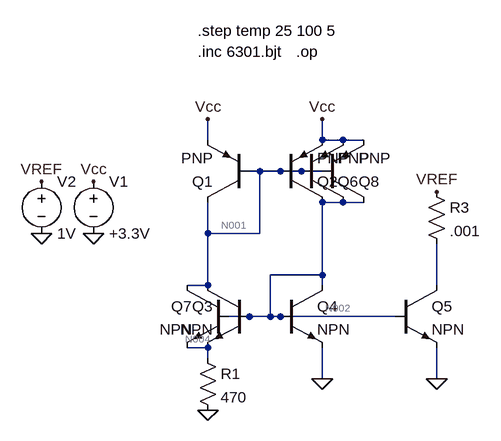
[diagram p0: schematic ptat.asc]
ptat.asc, the LTspice schematic file:
Version 4
SHEET 1 880 680
WIRE 64 48 64 16
WIRE 240 48 240 16
WIRE 272 48 240 48
WIRE 304 48 272 48
WIRE 144 96 128 96
WIRE 176 96 144 96
WIRE 208 96 176 96
WIRE 240 96 208 96
WIRE 272 144 240 144
WIRE 304 144 272 144
WIRE 64 192 64 144
WIRE 144 192 144 96
WIRE 144 192 64 192
WIRE 240 256 240 144
WIRE 240 256 160 256
WIRE 64 272 64 192
WIRE 64 272 32 272
WIRE 240 272 240 256
WIRE 416 272 416 208
WIRE 128 320 96 320
WIRE 160 320 160 256
WIRE 160 320 128 320
WIRE 176 320 160 320
WIRE 352 320 176 320
WIRE 64 368 32 368
WIRE 64 384 64 368
WIRE 240 416 240 368
WIRE 416 416 416 368
FLAG 240 416 0
FLAG 64 16 Vcc
FLAG 240 16 Vcc
FLAG 416 416 0
FLAG 64 464 0
FLAG -112 192 0
FLAG -112 112 Vcc
FLAG -192 192 0
FLAG -192 112 VREF
FLAG 416 128 VREF
SYMBOL pnp 176 144 M180
SYMATTR InstName Q2
SYMBOL pnp 128 144 R180
SYMATTR InstName Q1
SYMBOL npn 176 272 R0
SYMATTR InstName Q4
SYMBOL npn 352 272 R0
SYMATTR InstName Q5
SYMBOL npn 128 272 M0
SYMATTR InstName Q3
SYMBOL res 48 368 R0
SYMATTR InstName R1
SYMATTR Value 470
SYMBOL voltage -112 96 R0
WINDOW 123 0 0 Left 2
WINDOW 39 0 0 Left 2
SYMATTR InstName V1
SYMATTR Value +3.3V
SYMBOL npn 96 272 M0
SYMATTR InstName Q7
SYMBOL pnp 208 144 M180
SYMATTR InstName Q6
SYMBOL pnp 240 144 M180
SYMATTR InstName Q8
SYMBOL voltage -192 96 R0
WINDOW 123 0 0 Left 2
WINDOW 39 0 0 Left 2
SYMATTR InstName V2
SYMATTR Value 1V
SYMBOL res 400 112 R0
SYMATTR InstName R3
SYMATTR Value .001
TEXT 48 -88 Left 2 !.inc 6301.bjt
TEXT 200 -88 Left 2 !.op
TEXT 48 -120 Left 2 !.step temp 25 100 5

The netlist it stands for:
* ptat.asc
Q2 N002 N001 Vcc 0 PNP
Q1 N001 N001 Vcc 0 PNP
Q4 N002 N002 0 0 NPN
Q5 N003 N002 0 0 NPN
Q3 N001 N002 N004 0 NPN
R1 N004 0 470
V1 Vcc 0 +3.3V
Q7 N001 N002 N004 0 NPN
Q6 N002 N001 Vcc 0 PNP
Q8 N002 N001 Vcc 0 PNP
V2 VREF 0 1V
R3 VREF N003 .001
.model NPN NPN
.model PNP PNP
.lib standard.bjt
.inc 6301.bjt
.op
.step temp 25 100 5
.backanno
.end

* Results of the author's LTspice run, read from the files saved beside the schematic
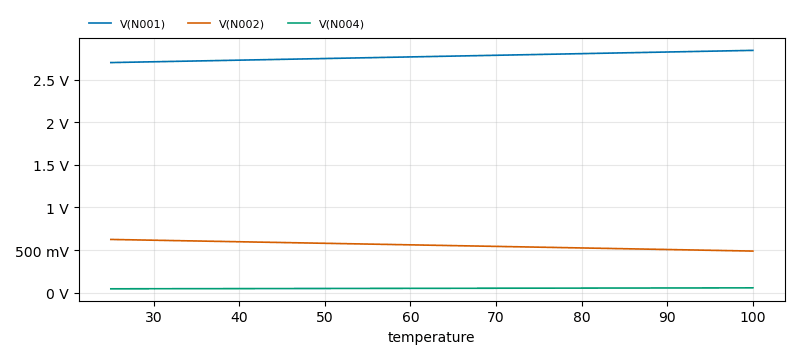
[diagram p1: Operating Point of ptat.asc, plotted from the saved traces]
* Operating Point, 1 run:
*   V(N001): 2.703 V at temperature=25 , 2.847 V at temperature=100 , min 2.703 V, max 2.847 V
*   V(N002): 624.4 mV at temperature=25 , 487.8 mV at temperature=100 , min 487.8 mV, max 624.4 mV
*   V(N004): 44.43 mV at temperature=25 , 55.61 mV at temperature=100 , min 44.43 mV, max 55.61 mV
* From the log:
*   Semiconductor Device Operating Points:
*                           --- Bipolar Transistors ---
*   Name:       q7          q3          q5          q4          q8
*   Model:      npn         npn         npn         npn         pnp
*   Ib:       4.68e-07    4.68e-07    2.64e-06    2.64e-06   -9.00e-07
*   Ic:       4.68e-05    4.68e-05    2.64e-04    2.64e-04   -9.00e-05
*   Vbe:      5.80e-01    5.80e-01    6.24e-01    6.24e-01   -5.97e-01
*   Vbc:     -2.08e+00   -2.08e+00   -3.76e-01    0.00e+00    2.08e+00
*   Vce:      2.66e+00    2.66e+00    1.00e+00    6.24e-01   -2.68e+00
*   BetaDC:   1.00e+02    1.00e+02    1.00e+02    1.00e+02    1.00e+02
*   Gm:       1.82e-03    1.82e-03    1.03e-02    1.03e-02    3.50e-03
*   Rpi:      5.49e+04    5.49e+04    9.74e+03    9.74e+03    2.85e+04
*   Rx:       0.00e+00    0.00e+00    0.00e+00    0.00e+00    0.00e+00
*   Ro:       4.81e+47    4.81e+47    7.80e+18    3.50e+12    4.81e+47
*   Cbe:      0.00e+00    0.00e+00    0.00e+00    0.00e+00    0.00e+00
*   Cbc:      0.00e+00    0.00e+00    0.00e+00    0.00e+00    0.00e+00
*   Cjs:      0.00e+00    0.00e+00    0.00e+00    0.00e+00    0.00e+00
*   BetaAC:   1.00e+02    1.00e+02    1.00e+02    1.00e+02    1.00e+02
*   Cbx:      0.00e+00    0.00e+00    0.00e+00    0.00e+00    0.00e+00
*   Ft:       0.00e+00    0.00e+00    0.00e+00    0.00e+00    0.00e+00
*   Name:       q6          q1          q2
*   Model:      pnp         pnp         pnp
*   Ib:      -9.00e-07   -9.00e-07   -9.00e-07
*   Ic:      -9.00e-05   -9.00e-05   -9.00e-05
*   Vbe:     -5.97e-01   -5.97e-01   -5.97e-01
*   Vbc:      2.08e+00    0.00e+00    2.08e+00
*   Vce:     -2.68e+00   -5.97e-01   -2.68e+00
*   BetaDC:   1.00e+02    1.00e+02    1.00e+02
*   Gm:       3.50e-03    3.50e-03    3.50e-03
*   Rpi:      2.85e+04    2.85e+04    2.85e+04
*   Rx:       0.00e+00    0.00e+00    0.00e+00
*   Ro:       4.81e+47    3.50e+12    4.81e+47
*   Cbe:      0.00e+00    0.00e+00    0.00e+00
*   Cbc:      0.00e+00    0.00e+00    0.00e+00
*   Cjs:      0.00e+00    0.00e+00    0.00e+00
*   BetaAC:   1.00e+02    1.00e+02    1.00e+02
*   Cbx:      0.00e+00    0.00e+00    0.00e+00
*   Ft:       0.00e+00    0.00e+00    0.00e+00